# EAGLE design BluJoy-2.1 (EAGLE 9.6.2)
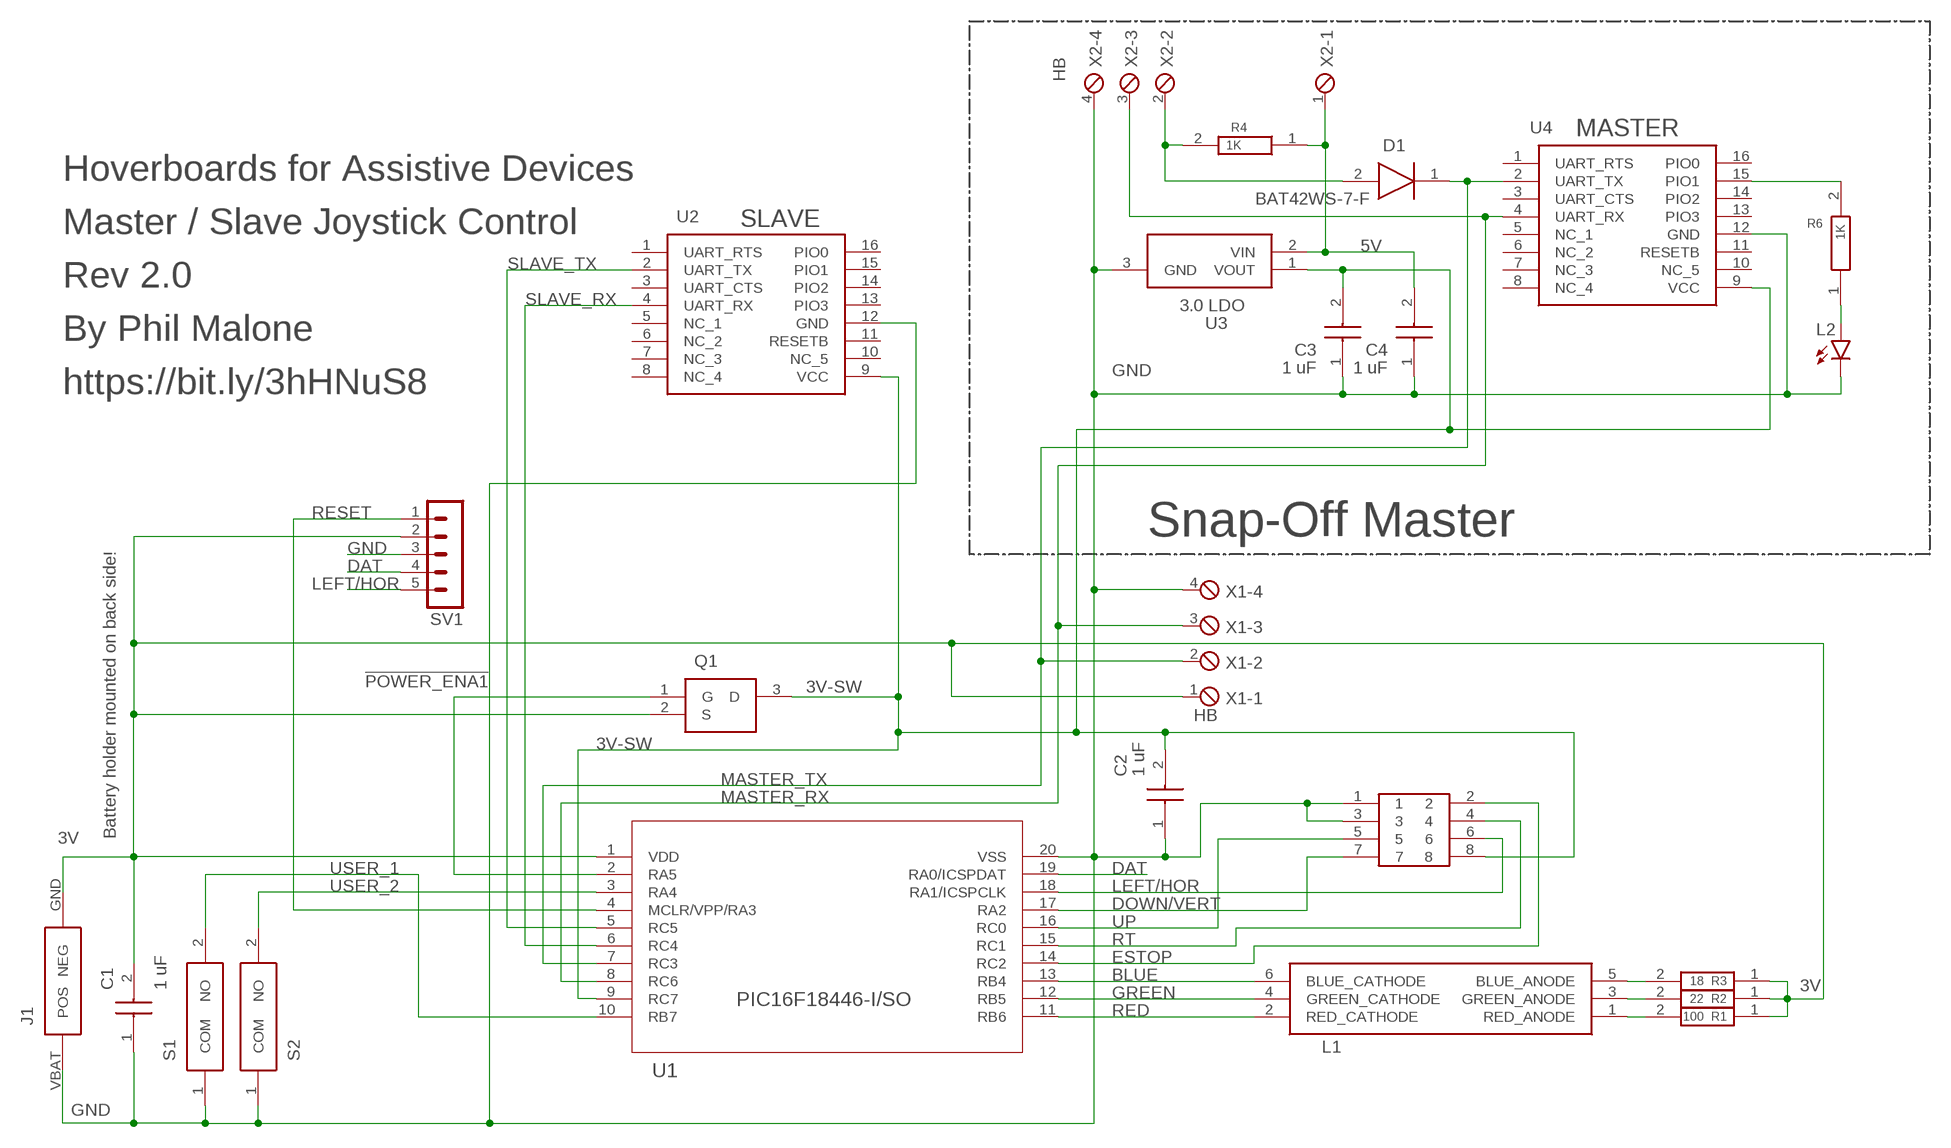
[diagram p0: schematic, sheet 1]

## Parts
C1  1 uF  CC0603KRX7R7BB104  [CAPC1608X90N]
C2  1 uF  CC0603KRX7R7BB104  [CAPC1608X90N]
C3  1 uF  CC0603KRX7R7BB104  [CAPC1608X90N]
C4  1 uF  CC0603KRX7R7BB104  [CAPC1608X90N]
D1  BAT42WS-7-F  [SOD2513X120N]
J1  2468  [2468]
J2  PHOENIX3.5X8-B  [1751303]
L1  ASMB-TTF0-0A20B  [ASMBTTF00A20B]
L2  LEDCHIP-LED0603  [CHIP-LED0603]
Q1  P-FET  NTR4171PT1G  [SOT96P237X111-3N]
R1  100  CRCW0603240RFKEB  [RESC1608X50N]
R2  22  CRCW0603240RFKEB  [RESC1608X50N]
R3  18  CRCW0603240RFKEB  [RESC1608X50N]
R4  1K  CRCW0603240RFKEB  [RESC1608X50N]
R6  1K  CRCW0603240RFKEB  [RESC1608X50N]
S1  PTS636_SK25J_SMTR_LFS  [PTS636SK25JSMTRLFS]
S2  PTS636_SK25J_SMTR_LFS  [PTS636SK25JSMTRLFS]
SV1  PICKIT  [MA05-1]
U1  PIC16F18446-I/SO  PIC16F15345-I/SO  [SOIC20_SO_MCH]
U2  HM-11  [HM-11-MODULE]
U3  3.0 LDO  MCP1812AT-030_TT  [SOT95P237X112-3N]
U4  HM-11  [HM-11-MODULE]
X1  HB  MPT4  [4POL254]
X2  HB  MPT4  [4POL254]

## Nets
3V: C1.2(C2) J1.GND(NEG) Q1.2(S) R1.1 R2.1 R3.1 SV1.2 U1.1(VDD) X1.1
3V-SW: C2.2(C2) C3.2(C2) J2.8 Q1.3(D) U1.9(RC7) U2.9(VCC) U3.1(VOUT) U4.9(VCC)
5V: C4.2(C2) R4.1 U3.2(VIN) X2.1
!POWER_ENA1: Q1.1(G) U1.2(RA5)
BLUE: L1.6(BLUE_CATHODE) U1.13(RB4)
DAT: SV1.4 U1.19(RA0/ICSPDAT)
DOWN/VERT: J2.7 U1.17(RA2)
ESTOP: J2.2 U1.14(RC2)
GND: C1.1(C1) C2.1(C1) C3.1(C1) C4.1(C1) J1.VBAT(POS) J2.1 J2.3 L2.C S1.1(COM) S2.1(COM) SV1.3 U1.20(VSS) U2.12(GND) U3.3(GND) U4.12(GND) X1.4 X2.4
GREEN: L1.4(GREEN_CATHODE) U1.12(RB5)
LEFT/HOR: J2.6 SV1.5 U1.18(RA1/ICSPCLK)
MASTER_RX: U1.8(RC6) U4.4(UART_RX) X1.3 X2.3
MASTER_TX: D1.1(K) U1.7(RC3) U4.2(UART_TX) X1.2
N$1: D1.2(A) R4.2 X2.2
N$2: R6.2 U4.15(PIO1)
N$3: L2.A R6.1
N$5: L1.1(RED_ANODE) R1.2
N$6: L1.3(GREEN_ANODE) R2.2
N$7: L1.5(BLUE_ANODE) R3.2
RED: L1.2(RED_CATHODE) U1.11(RB6)
RESET: SV1.1 U1.4(MCLR/VPP/RA3)
RT: J2.4 U1.15(RC1)
SLAVE_RX: U1.6(RC4) U2.4(UART_RX)
SLAVE_TX: U1.5(RC5) U2.2(UART_TX)
UP: J2.5 U1.16(RC0)
USER_1: S1.2(NO) U1.10(RB7)
USER_2: S2.2(NO) U1.3(RA4)
Unconnected: U2.1(UART_RTS) U2.3(UART_CTS) U2.5(NC_1) U2.6(NC_2) U2.7(NC_3) U2.8(NC_4) U2.10(NC_5) U2.11(RESETB) U2.13(PIO3) U2.14(PIO2) U2.15(PIO1) U2.16(PIO0) U4.1(UART_RTS) U4.3(UART_CTS) U4.5(NC_1) U4.6(NC_2) U4.7(NC_3) U4.8(NC_4) U4.10(NC_5) U4.11(RESETB) U4.13(PIO3) U4.14(PIO2) U4.16(PIO0)

## Notes on the sheet
- MASTER
- Hoverboards for Assistive Devices
- SLAVE
- Master / Slave Joystick Control
- Rev 2.0
- By Phil Malone
- https://bit.ly/3hHNuS8
- Snap-Off Master
- Battery holder mounted on back side!

## Library data of the parts
C1-C4 = BluJoy-e:CC0603KRX7R7BB104: CAPACITOR, 0603 100nF +/-10% 16V Source: Datasheet <http://componentsearchengine.com/Datasheets/1/CC0603KRX7R7BB104.pdf>; DESCRIPTION: CAPACITOR, 0603 100nF +/-10% 16V; HEIGHT: mm; MANUFACTURER_NAME: YAGEO (PHYCOMP); MANUFACTURER_PART_NUMBER: CC0603KRX7R7BB104; MOUSER_PART_NUMBER: 603-CC603KRX7R7BB104; MOUSER_PRICE-STOCK: https://www.mouser.com/Search/Refine.aspx?Keyword=603-CC603KRX7R7BB104; RS_PART_NUMBER: 6698763; RS_PRICE-STOCK: http://uk.rs-online.com/web/p/products/6698763
D1 = BluJoy-e:BAT42WS-7-F: DIODES INC. - BAT42WS-7-F - Small Signal Schottky Diode, Single, 30 V, 200 mA, 650 mV, 4 A, 125 C Source: Datasheet <https://componentsearchengine.com/Datasheets/2/BAT42WS-7-F.pdf>; ARROW_PART_NUMBER: BAT42WS-7-F; ARROW_PRICE-STOCK: https://www.arrow.com/en/products/bat42ws-7-f/diodes-incorporated; DESCRIPTION: DIODES INC. - BAT42WS-7-F - Small Signal Schottky Diode, Single, 30 V, 200 mA, 650 mV, 4 A, 125 C; HEIGHT: 1.2mm; MANUFACTURER_NAME: Diodes Inc.; MANUFACTURER_PART_NUMBER: BAT42WS-7-F; MOUSER_PART_NUMBER: 621-BAT42WS-F; MOUSER_PRICE-STOCK: https://www.mouser.co.uk/ProductDetail/Diodes-Incorporated/BAT42WS-7-F?qs=m4hD82FvRu0XtK2r8jLwYA%3D%3D
J1 = BluJoy-e:2468: Cylindrical Battery Contacts, Clips, Holders & Springs 2AAA PC MNT HOLDER Source: Datasheet <http://docs-emea.rs-online.com/webdocs/002e/0900766b8002ef75.pdf>; ALLIED_NUMBER: 70182756; ALLIED_PRICE-STOCK: http://www.alliedelec.com/keystone-electronics-2468/70182756/; DESCRIPTION: Cylindrical Battery Contacts, Clips, Holders & Springs 2AAA PC MNT HOLDER; HEIGHT: mm; MANUFACTURER_NAME: Keystone Electronics; MANUFACTURER_PART_NUMBER: 2468; MOUSER_PART_NUMBER: 534-2468; MOUSER_PRICE-STOCK: https://www.mouser.com/Search/Refine.aspx?Keyword=534-2468; RS_PART_NUMBER: 2794965; RS_PRICE-STOCK: http://uk.rs-online.com/web/p/products/2794965
J2 = BluJoy-e:PHOENIX3.5X8-B
L1 = BluJoy-e:ASMB-TTF0-0A20B: BROADCOM LIMITED - ASMB-TTF0-0A20B - LED, RGB, 710/1840/410MCD, PLCC-6 Source: Datasheet <https://componentsearchengine.com/Datasheets/1/ASMB-TTF0-0A20B.pdf>; DESCRIPTION: BROADCOM LIMITED - ASMB-TTF0-0A20B - LED, RGB, 710/1840/410MCD, PLCC-6; HEIGHT: 2mm; MANUFACTURER_NAME: Avago Technologies; MANUFACTURER_PART_NUMBER: ASMB-TTF0-0A20B; MOUSER_PART_NUMBER: 630-ASMB-TTF0-0A20B; MOUSER_PRICE-STOCK: https://www.mouser.com/Search/Refine.aspx?Keyword=630-ASMB-TTF0-0A20B
L2 = BluJoy-e:LED: LED OSRAM: - CHIPLED LG R971, LG N971, LY N971, LG Q971, LY Q971, LO R971, LY R971 LH N974, LH R974 LS Q976, LO Q976, LY Q976 LO Q996 - Hyper CHIPLED LW Q18S LB Q993, LB Q99A, LB R99A - SideLED LS A670, LO A670, LY A670, LG A670, LP A670 LB A673, LV A673, LT A673, LW A673 LH A674 LY A675 LS A676, LA A676, LO A676, LY A676, LW A676 LS A679, LY A679, LG A679 - Hyper Micro SIDELED® LS Y876, LA Y876, LO Y876, LY Y876 LT Y87S - SmartLED LW L88C, LW L88S LB L89C, LB L89S, LG L890 LS L89K, LO L89K, LY L89K LS L896, LA L896, LO L896, LY L896 - TOPLED LS T670, LO T670, LY T670, LG T670, LP T670 LSG T670, LSP T670, LSY T670, LOP T670, LYG T670 LG T671, LOG T671, LSG T671 LB T673, LV T673, LT T673, LW T673 LH T674 LS T676, LA T676, LO T676, LY T676, LB T676, LH T676, LSB T676, LW T676 LB T67C, LV T67C, LT T67C, LS T67K, LO T67K, LY T67K, LW E67C LS E67B, LA E67B, LO E67B, LY E67B, LB E67C, LV E67C, LT E67C LW T67C LS T679, LY T679, LG T679 LS T770, LO T770, LY T770, LG T770, LP T770 LB T773, LV T773, LT T773, LW T773 LH T774 LS E675, LA E675, LY E675, LS T675 LS T776, LA T776, LO T776, LY T776, LB T776 LHGB T686 LT T68C, LB T68C - Hyper Mini TOPLED® LB M676 - Mini TOPLED Santana® LG M470 LS M47K, LO M47K, LY M47K Source: http://www.osram.convergy.de LUXEON: - LUMILED® LXK2-PW12-R00, LXK2-PW12-S00, LXK2-PW14-U00, LXK2-PW14-V00 LXK2-PM12-R00, LXK2-PM12-S00, LXK2-PM14-U00 LXK2-PE12-Q00, LXK2-PE12-R00, LXK2-PE12-S00, LXK2-PE14-T00, LXK2-PE14-U00 LXK2-PB12-K00, LXK2-PB12-L00, LXK2-PB12-M00, LXK2-PB14-N00, LXK2-PB14-P00, LXK2-PB14-Q00 LXK2-PR12-L00, LXK2-PR12-M00, LXK2-PR14-Q00, LXK2-PR14-R00 LXK2-PD12-Q00, LXK2-PD12-R00, LXK2-PD12-S00 LXK2-PH12-R00, LXK2-PH12-S00 LXK2-PL12-P00, LXK2-PL12-Q00, LXK2-PL12-R00 Source: www.luxeon.com KINGBRIGHT: KA-3528ASYC Source: www.kingbright.com
Q1 = BluJoy-e:NTR4171PT1G: Power MOSFET Source: Datasheet <http://www.onsemi.com/pub/Collateral/NTR4171P-D.PDF>; ARROW_PART_NUMBER: NTR4171PT1G; ARROW_PRICE-STOCK: https://www.arrow.com/en/products/ntr4171pt1g/on-semiconductor; DESCRIPTION: Power MOSFET; HEIGHT: 1.11mm; MANUFACTURER_NAME: ON Semiconductor; MANUFACTURER_PART_NUMBER: NTR4171PT1G; MOUSER_PART_NUMBER: 863-NTR4171PT1G; MOUSER_PRICE-STOCK: https://www.mouser.co.uk/ProductDetail/ON-Semiconductor/NTR4171PT1G?qs=N5dOQkml4H8L27wHnYyw3w%3D%3D
R1-R4 R6 = BluJoy-e:CRCW0603240RFKEB: Thick Film Resistors - SMD 1/10watt 240ohms 1% Source: Datasheet <http://www.vishay.com/docs/20035/dcrcwe3.pdf>; DESCRIPTION: Thick Film Resistors - SMD 1/10watt 240ohms 1%; HEIGHT: 0.5mm; MANUFACTURER_NAME: Vishay; MANUFACTURER_PART_NUMBER: CRCW0603240RFKEB; MOUSER_PART_NUMBER: 71-CRCW0603240RFKEB; MOUSER_PRICE-STOCK: https://www.mouser.com/Search/Refine.aspx?Keyword=71-CRCW0603240RFKEB
S1 S2 = BluJoy-e:PTS636_SK25J_SMTR_LFS: Tactile Switches Tact 50mA 12VDC, 6.0x3.5, 2.5mm H, 250gf, J leads, No ground pin, Red Actuator Source: Datasheet <https://www.mouser.com/datasheet/2/60/pts636-1550567.pdf>; DESCRIPTION: Tactile Switches Tact 50mA 12VDC, 6.0x3.5, 2.5mm H, 250gf, J leads, No ground pin, Red Actuator; HEIGHT: 2.7mm; MANUFACTURER_NAME: C & K COMPONENTS; MANUFACTURER_PART_NUMBER: PTS636 SK25J SMTR LFS; MOUSER_PART_NUMBER: 611-PTS636SK25JSMTRL; MOUSER_PRICE-STOCK: https://www.mouser.com/Search/Refine.aspx?Keyword=611-PTS636SK25JSMTRL
SV1 = BluJoy-e:PICKIT: PIN HEADER; OC_FARNELL: unknown; OC_NEWARK: unknown
U1 = BluJoy-e:PIC16F15345-I/SO; BUILT_BY: EMA_Cory; COPYRIGHT: Copyright (C) 2018 Accelerated Designs. All rights reserved; DATASHEET: http://ww1.microchip.com/downloads/en/DeviceDoc/PIC16-L-F15325-45-Data-Sheet-40001865D.pdf; MANUFACTURER_PART_NUMBER: PIC16F15345-I/SO; SOURCELIBRARY: Microchip_2020-03-04; VENDOR: Microchip
U2 U4 = BluJoy-e:HM-11: Bluetooth 4.0 BLE module Source: Datasheet <https://www.seeedstudio.com/wiki/images/c/cd/Bluetooth4_en.pdf>; ARROW_PART_NUMBER: HM-11; DESCRIPTION: Bluetooth 4.0 BLE module; HEIGHT: mm; MANUFACTURER_NAME: Huamao technology Co; MANUFACTURER_PART_NUMBER: HM-11
U3 = BluJoy-e:MCP1812AT-030_TT: LDO Voltage Regulators Ultra Low Iq LDO Source: Datasheet <https://mouser.componentsearchengine.com/Datasheets/1/MCP1812AT-030_TT.pdf>; ARROW_PART_NUMBER: MCP1812AT-030/TT; DESCRIPTION: LDO Voltage Regulators Ultra Low Iq LDO; HEIGHT: 1.12mm; MANUFACTURER_NAME: Microchip; MANUFACTURER_PART_NUMBER: MCP1812AT-030/TT; MOUSER_PART_NUMBER: 579-MCP1812AT-030/TT; MOUSER_PRICE-STOCK: https://www.mouser.co.uk/ProductDetail/Microchip-Technology/MCP1812AT-030-TT?qs=byeeYqUIh0Pab4jw7Ms6qQ%3D%3D
X1 X2 = BluJoy-e:MPT4: PHOENIX CONNECTOR; OC_FARNELL: unknown; OC_NEWARK: unknown

## Board
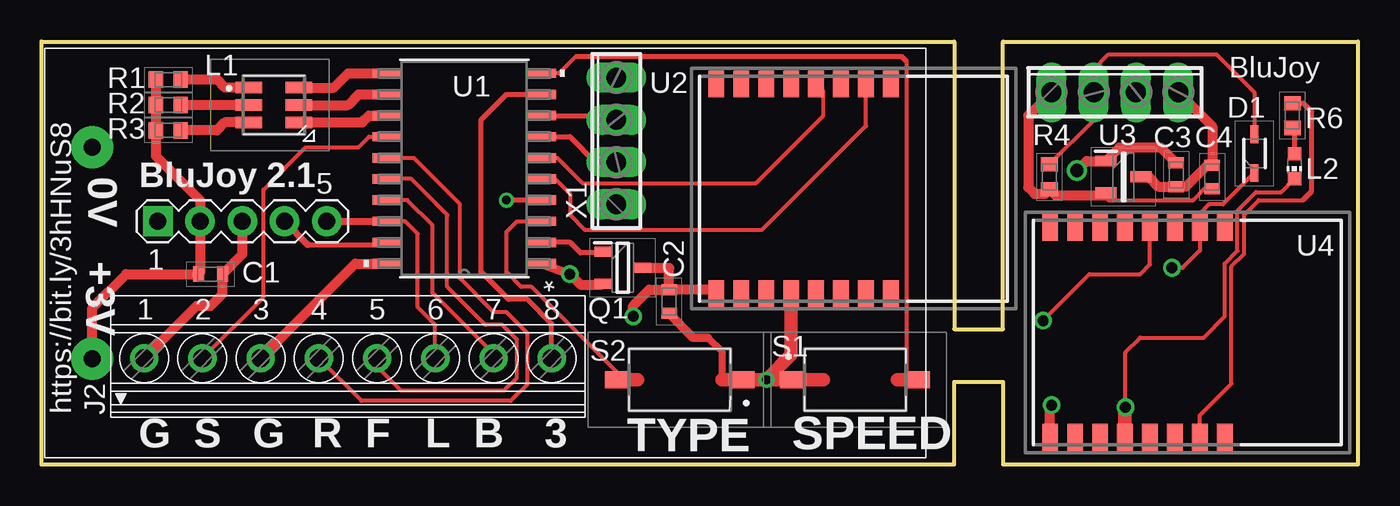
[diagram p1: board, top side]
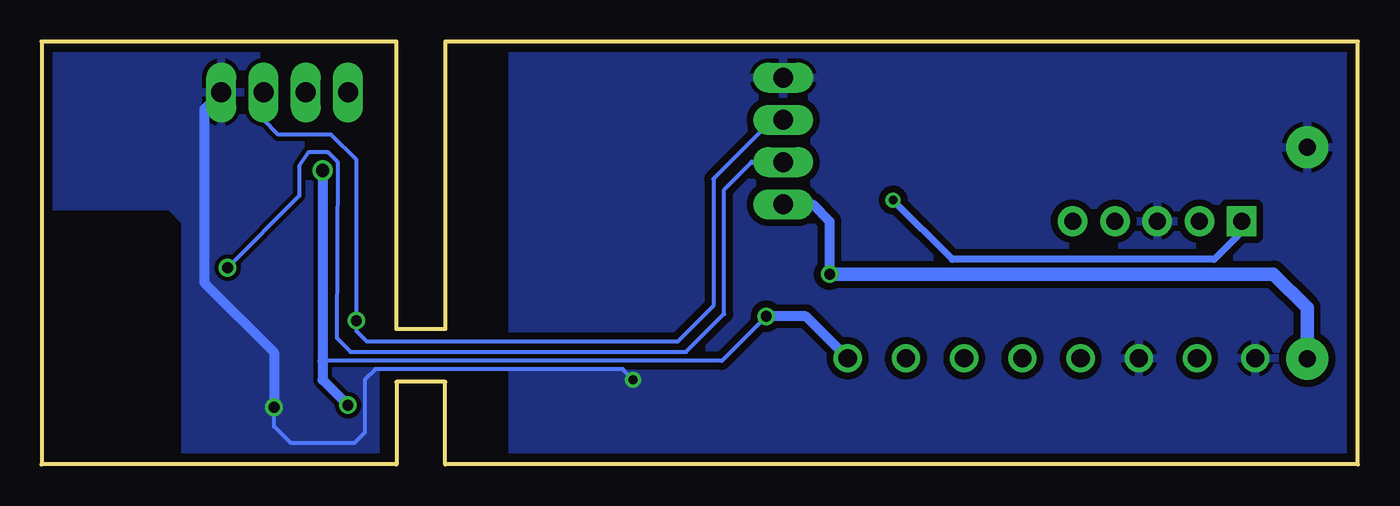
[diagram p2: board, bottom side, seen from below]

Size 79.12 x 25.4 mm. Coordinates in mm from the lower left corner, seen from the top.
Outline: 0,0 0,25.4 54.86,25.4 54.86,8.13 57.78,8.13 57.78,25.4 79.12,25.4 79.12,0 57.78,0 57.78,4.95 54.86,4.95 54.86,0 0,0
Copper layers (1*16): Top 0.035mm / dielectric 1.5mm / Bottom 0.035mm
Design rules "default *": minimum track width 6mil, minimum drill 0.35mm, track to track 6mil, track to pad 6mil, pad to pad 6mil, via to via 6mil, smd to smd 6mil, copper to edge 20mil, drill to drill 6mil, minimum pad ring 10mil, minimum via ring 8mil, stop-mask expansion 4mil, vias tented up to drill 0mil, thermal gap 10mil

### Footprints (pad centres in the part's own frame; a part is rotated, then mirrored left to right if it is on the bottom)
CAPC1608X90N = smd 0.66 x 0.94: 1 -0.711,0; 2 0.711,0
SOD2513X120N = smd 1.075 x 0.5: 1 -1.162,0; 2 1.162,0
2468 = drill 1.02 pad 2.54: GND 23.625,6.35; VBAT 23.625,-6.35
1751303 = drill 1.1 pad 1.7: 1 -12.25,-0.1; 2 -8.75,-0.1; 3 -5.25,-0.1; 4 -1.75,-0.1; 5 1.75,-0.1; 6 5.25,-0.1; 7 8.75,-0.1; 8 12.25,-0.1
ASMBTTF00A20B = smd 1.6 x 0.7: 1 -1.5,1.05; 2 1.5,1.05; 3 -1.5,0; 4 1.5,0; 5 -1.5,-1.05; 6 1.5,-1.05
CHIP-LED0603 = smd 0.8 x 0.8: A 0,-0.75; C 0,0.75
SOT96P237X111-3N = smd 1 x 0.6: 1 -1.2,0.955; 2 -1.2,-0.955; 3 1.2,0
RESC1608X50N = smd 0.85 x 1: 1 -0.75,0; 2 0.75,0
PTS636SK25JSMTRLFS = smd 1.45 x 1: 1 -3.775,0; 2 3.775,0
MA05-1 = drill 1.016 pad 1.778 square: 1 -5.08,0 | drill 1.016 pad 1.778: 2 -2.54,0; 3 0,0; 4 2.54,0; 5 5.08,0
SOIC20_SO_MCH = smd 1.765 x 0.559: 1 -4.629,5.715; 2 -4.629,4.445; 3 -4.629,3.175; 4 -4.629,1.905; 5 -4.629,0.635; 6 -4.629,-0.635; 7 -4.629,-1.905; 8 -4.629,-3.175; 9 -4.629,-4.445; 10 -4.629,-5.715; 11 4.629,-5.715; 12 4.629,-4.445; 13 4.629,-3.175; 14 4.629,-1.905; 15 4.629,-0.635; 16 4.629,0.635; 17 4.629,1.905; 18 4.629,3.175; 19 4.629,4.445; 20 4.629,5.715
HM-11-MODULE = smd 1.6 x 0.95: 1 0,0; 2 0,-1.5; 3 0,-3; 4 0,-4.5; 5 0,-6; 6 0,-7.5; 7 0,-9; 8 0,-10.5; 9 12.6,-10.5; 10 12.6,-9; 11 12.6,-7.5; 12 12.6,-6; 13 12.6,-4.5; 14 12.6,-3; 15 12.6,-1.5; 16 12.6,0
SOT95P237X112-3N = smd 1.25 x 0.65: 1 -1.05,0.95; 2 -1.05,-0.95; 3 1.05,0
4POL254 = drill 1.2 long: 1 -3.81,0; 2 -1.27,0; 3 1.27,0; 4 3.81,0

### Placement (x,y rotation side)
C1  10.16,11.43 180 top
C2  37.72,9.78 90 top
C3  68.2,17.4 90 top
C4  70.36,17.27 270 top
D1  72.9,18.67 90 top
J1  26.67,12.7 180 top
J2  18.41,6.48 0 top
L1  13.97,21.59 0 top
L2  75.31,17.91 180 top
Q1  34.92,11.81 0 top
R1  7.62,23.11 0 top
R2  7.62,21.59 0 top
R3  7.62,20.07 0 top
R4  60.58,17.27 90 top
R6  75.18,20.95 90 top
S1  48.9,5.08 0 top
S2  38.35,5.08 180 top
SV1  12.06,14.61 0 top
U1  25.4,17.78 180 top
U2  51.05,22.86 270 top
U3  65.02,17.27 0 top
U4  71.12,14.22 270 top
X1  34.54,19.43 90 top
X2  64.52,22.35 0 top

### Tracks (layer width: path | path; a pad name or v marks a point on that pad's centre or on a via)
3V  (via drill 0.65)
  Top 0.254: 33.66,10.79 Q1.2
  Top 0.508: U1.1 v31.75,11.43
  Top 0.61: R1.1 R2.1 R3.1 6.87,18.53 9.53,15.88 SV1.2 9.53,11.51 C1.2 5.08,11.43 3.04,9.39 J1.GND | v31.75,11.43 32.38,10.79 33.66,10.79
  Bottom 0.61: X1.1 32.77,15.62 31.75,14.61 v31.75,11.43
  Bottom 0.813: J1.GND 3.04,9.39 5.08,11.43 v31.75,11.43
3V-SW  (via drill 0.65, 0.8)
  Top 0.254: U3.1 63.75,18.22
  Top 0.305: J2.8 30.66,8.45 29.21,9.91 28.07,9.91 26.42,11.56 26.42,20.7 27.94,22.23 U1.9
  Top 0.406: 68.09,18.22 C3.2
  Top 0.61: U4.9 60.62,3.47 v60.71,3.56 | v62.23,17.65 62.8,18.22 63.75,18.22 | U3.1 64.77,19.02 64.77,19.05 67.26,19.05 68.09,18.22 | U2.9 40.32,10.49 C2.2 | C2.2 37.72,11.81 Q1.3 | C2.2 36.52,10.49 35.56,9.53 v35.56,8.89
  Bottom 0.254: v35.56,8.89 38.23,6.22 62.23,6.22
  Bottom 0.61: v62.23,17.65 62.23,6.22 62.23,5.08 v60.71,3.56 | J2.8 33.18,8.89 v35.56,8.89
5V
  Top 0.254: U3.2 63.97,16.04 | 63.87,16.14 63.97,16.04 | 63.97,16.04 64.14,15.88 69.22,15.88 69.9,16.56 C4.2
  Top 0.61: X2.1 59.31,20.95 59.31,16.64 59.69,16.26 60.31,16.26 R4.1 60.96,16.14 63.87,16.14
!POWER_ENA1
  Top 0.305: Q1.1 33.66,12.7 32.38,12.7 31.75,13.34 U1.2
BLUE
  Top 0.61: L1.6 19.27,20.54 19.68,20.95 U1.13
DAT
  Top 0.305: U1.19 20.64,13.21 16,13.21
  Top 0.406: SV1.4 16,13.21
DOWN/VERT
  Top 0.254: J2.7 27.16,6.63 23.5,10.3 23.5,14.35 21.97,15.88 U1.17
ESTOP
  Top 0.254: J2.2 13.34,10.05 13.34,16.51 15.88,19.05 19.05,19.05 19.68,19.68 U1.14
GND  (via drill 0.55, 0.65)
  Top 0.254: v65.15,3.43 65.15,6.73 66.04,7.62 69.85,7.62 71.12,8.89 71.12,12.06 71.87,12.82 71.87,15.24 72.99,16.36 74.51,16.36 L2.C
  Top 0.406: 40.06,7.62 40.89,6.78 40.89,5.08
  Top 0.508: 40.06,7.62 39.17,7.62 C2.1
  Top 0.61: SV1.3 12.06,12.62 C1.1 10.87,10.24 10.16,9.53 9.31,9.53 J2.1 | J2.3 18.85,12.06 U1.20 | X2.4 70.36,20.32 C4.1 70.08,17.98 68.78,16.69 C3.1 67.13,16.69 66.55,17.27 U3.3
  Top 0.813: v43.56,5.08 S2.1 | v43.56,5.08 S1.1 46.99,5.08 | S2.1 42.51,5.08 | U4.12 65.12,3.4 v65.15,3.43 | 40.89,5.08 S2.1 | U2.12 45.05,6.57 v43.56,5.08
  Bottom 0.254: v43.56,5.08 44.2,5.71 59.05,5.71 59.69,5.08 59.69,1.91 60.33,1.27 64.14,1.27 65.15,2.29 v65.15,3.43
  Bottom 0.61: X2.4 69.34,21.34 69.34,10.92 65.15,6.73 v65.15,3.43
  pour Bottom (isolate 0.406): 0.64,24.77 50.8,24.77 50.8,0.64 0.64,0.64
  pour Bottom (isolate 0.254): 59.05,24.89 78.61,24.89 78.74,24.77 78.74,15.49 71.37,15.49 70.48,14.61 70.48,0.51 59.05,0.51
GREEN
  Top 0.61: U1.12 19.05,22.23 18.41,21.59 L1.4
LEFT/HOR
  Top 0.254: J2.6 23.66,8.38 22.61,9.44 22.61,13.84 21.84,14.61 U1.18
  Top 0.406: SV1.5 U1.18
MASTER_RX  (via drill 0.65)
  Top 0.254: v60.2,8.64 62.99,11.43 66.04,11.43 66.62,12.01 U4.4
  Top 0.305: U1.8 34.29,20.95 X1.3
  Bottom 0.254: X1.3 35.18,20.7 38.73,17.14 38.73,9.53 40.89,7.37 59.56,7.37 60.2,8 v60.2,8.64 60.2,18.29 61.72,19.81 64.89,19.81 65.79,20.7 X2.3
MASTER_TX  (via drill 0.65)
  Top 0.254: D1.1 71.01,15.62 70.17,15.62 69.62,15.07 U4.2 69.62,12.85 68.58,11.81 v67.94,11.81
  Top 0.305: U1.7 31.75,19.68 33.27,18.16 X1.2
  Bottom 0.254: 36.45,18.16 38.1,16.51 38.1,9.04 40.39,6.76 60.55,6.76 61.37,7.59 61.33,18.17 61.9,18.74 63.08,18.74 63.63,17.91 63.63,16.13 v67.94,11.81
  Bottom 0.305: 36.45,18.16 X1.2
N$1
  Top 0.254: R4.2 63.25,20.69 X2.2 63.25,23.75 64.14,24.64 70.61,24.64 72.9,22.35 D1.2
N$2
  Top 0.254: U4.15 69.62,2.94 71.53,4.85 71.53,11.9 72.28,12.65 72.28,15 73.15,15.88 75.82,15.88
  Top 0.305: R6.2 75.83,21.7 76.33,21.21 76.33,16.38 75.82,15.88
N$3
  Top 0.305: R6.1 75.31,20.08 L2.A
N$5
  Top 0.61: L1.1 11.02,22.64 10.54,23.11 R1.2
N$6
  Top 0.61: L1.3 R2.2
N$7
  Top 0.61: L1.5 11.02,20.54 10.54,20.07 R3.2
RED
  Top 0.61: L1.2 17.56,22.64 18.41,23.5 U1.11
RESET  (via drill 0.5)
  Top 0.305: U1.4 v27.94,15.88
  Bottom 0.406: SV1.1 6.99,13.97 8.64,12.32 24.38,12.32 v27.94,15.88
RT
  Top 0.254: U1.15 22.35,18.41 25.15,15.62 25.15,11.18 27.18,9.14 27.94,9.14 29.21,7.87 29.21,4.83 28.19,3.81 19.23,3.81 J2.4
SLAVE_RX
  Top 0.254: U2.4 46.99,22.42 46.99,20.95 42.93,16.89 32.51,16.89 30.99,18.41 U1.6
SLAVE_TX
  Top 0.254: U2.2 49.55,20.34 43.31,14.1 32.64,14.1 31.75,14.99 31.75,16.26 30.86,17.14 U1.5
UP
  Top 0.254: J2.5 20.16,5.87 21.59,4.45 27.81,4.45 28.57,5.21 28.57,7.49 27.69,8.38 26.67,8.38 24.38,10.67 24.38,14.99 22.23,17.14 U1.16
USER_1
  Top 0.254: 32.13,24.51 31.11,23.5 U1.10 | 51.97,24.23 51.97,5.4 52.29,5.08 S1.2
  Top 0.305: 32.13,24.51 51.69,24.51 51.97,24.23
  Top 0.813: 51.44,5.08 S1.2
USER_2
  Top 0.254: 34.92,5.08 34.92,5.21 29.46,10.67 28.83,10.67 27.94,11.56 27.94,13.97 28.57,14.61 U1.3
  Top 0.813: 34.92,5.08 S2.2 35.81,5.08

### Text on the board
tPlace: BluJoy | 0V | BluJoy 2.1 | +3V | https://bit.ly/3hHNuS8 | G S | G | R F L B | 3 | TYPE | SPEED